# EAGLE schematic PEGMARev0 (EAGLE 6.6.0)
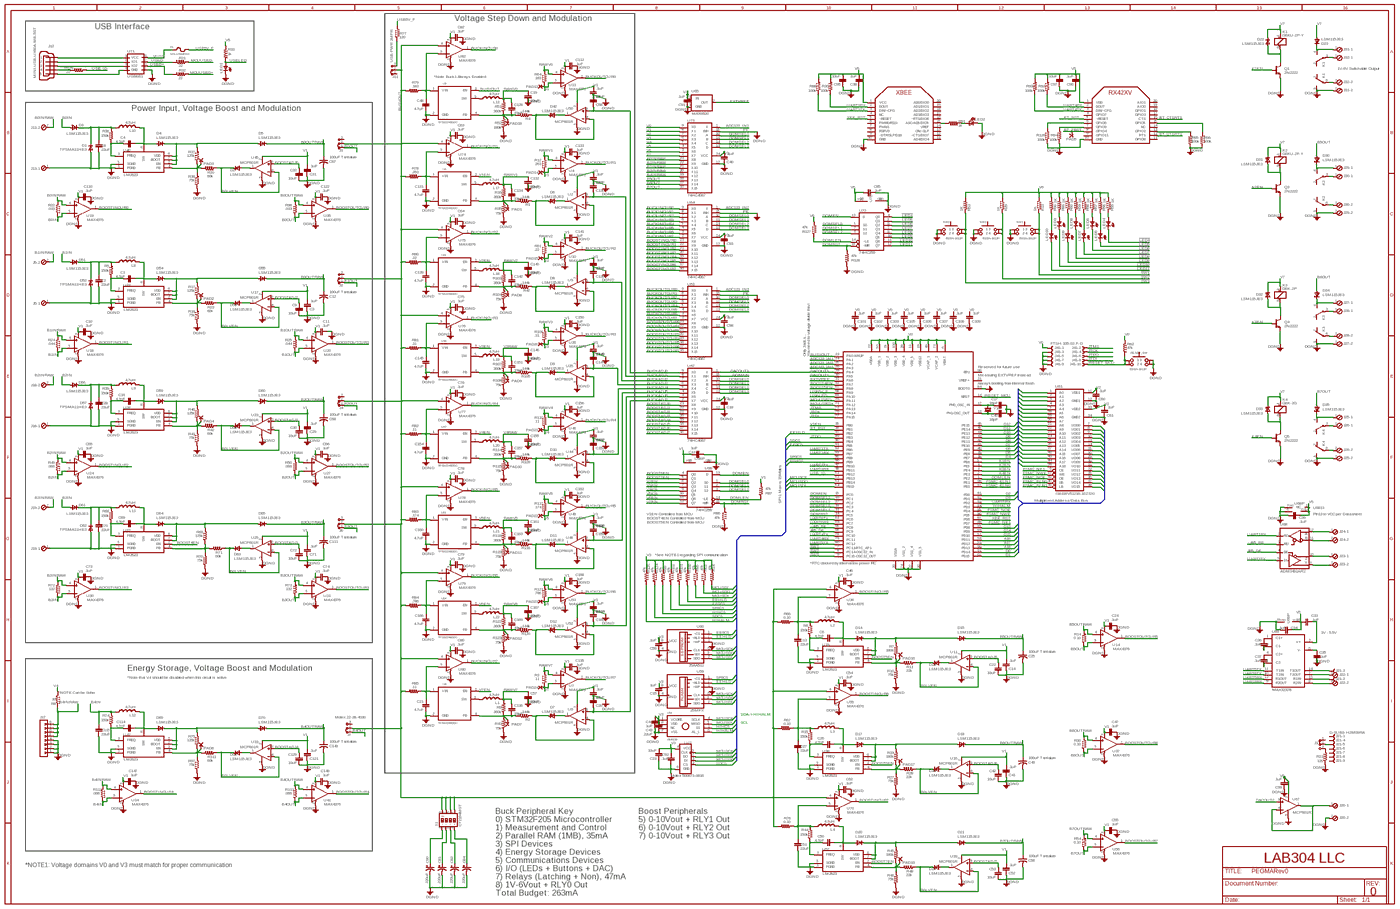
[diagram p0: schematic, sheet 1, overview]
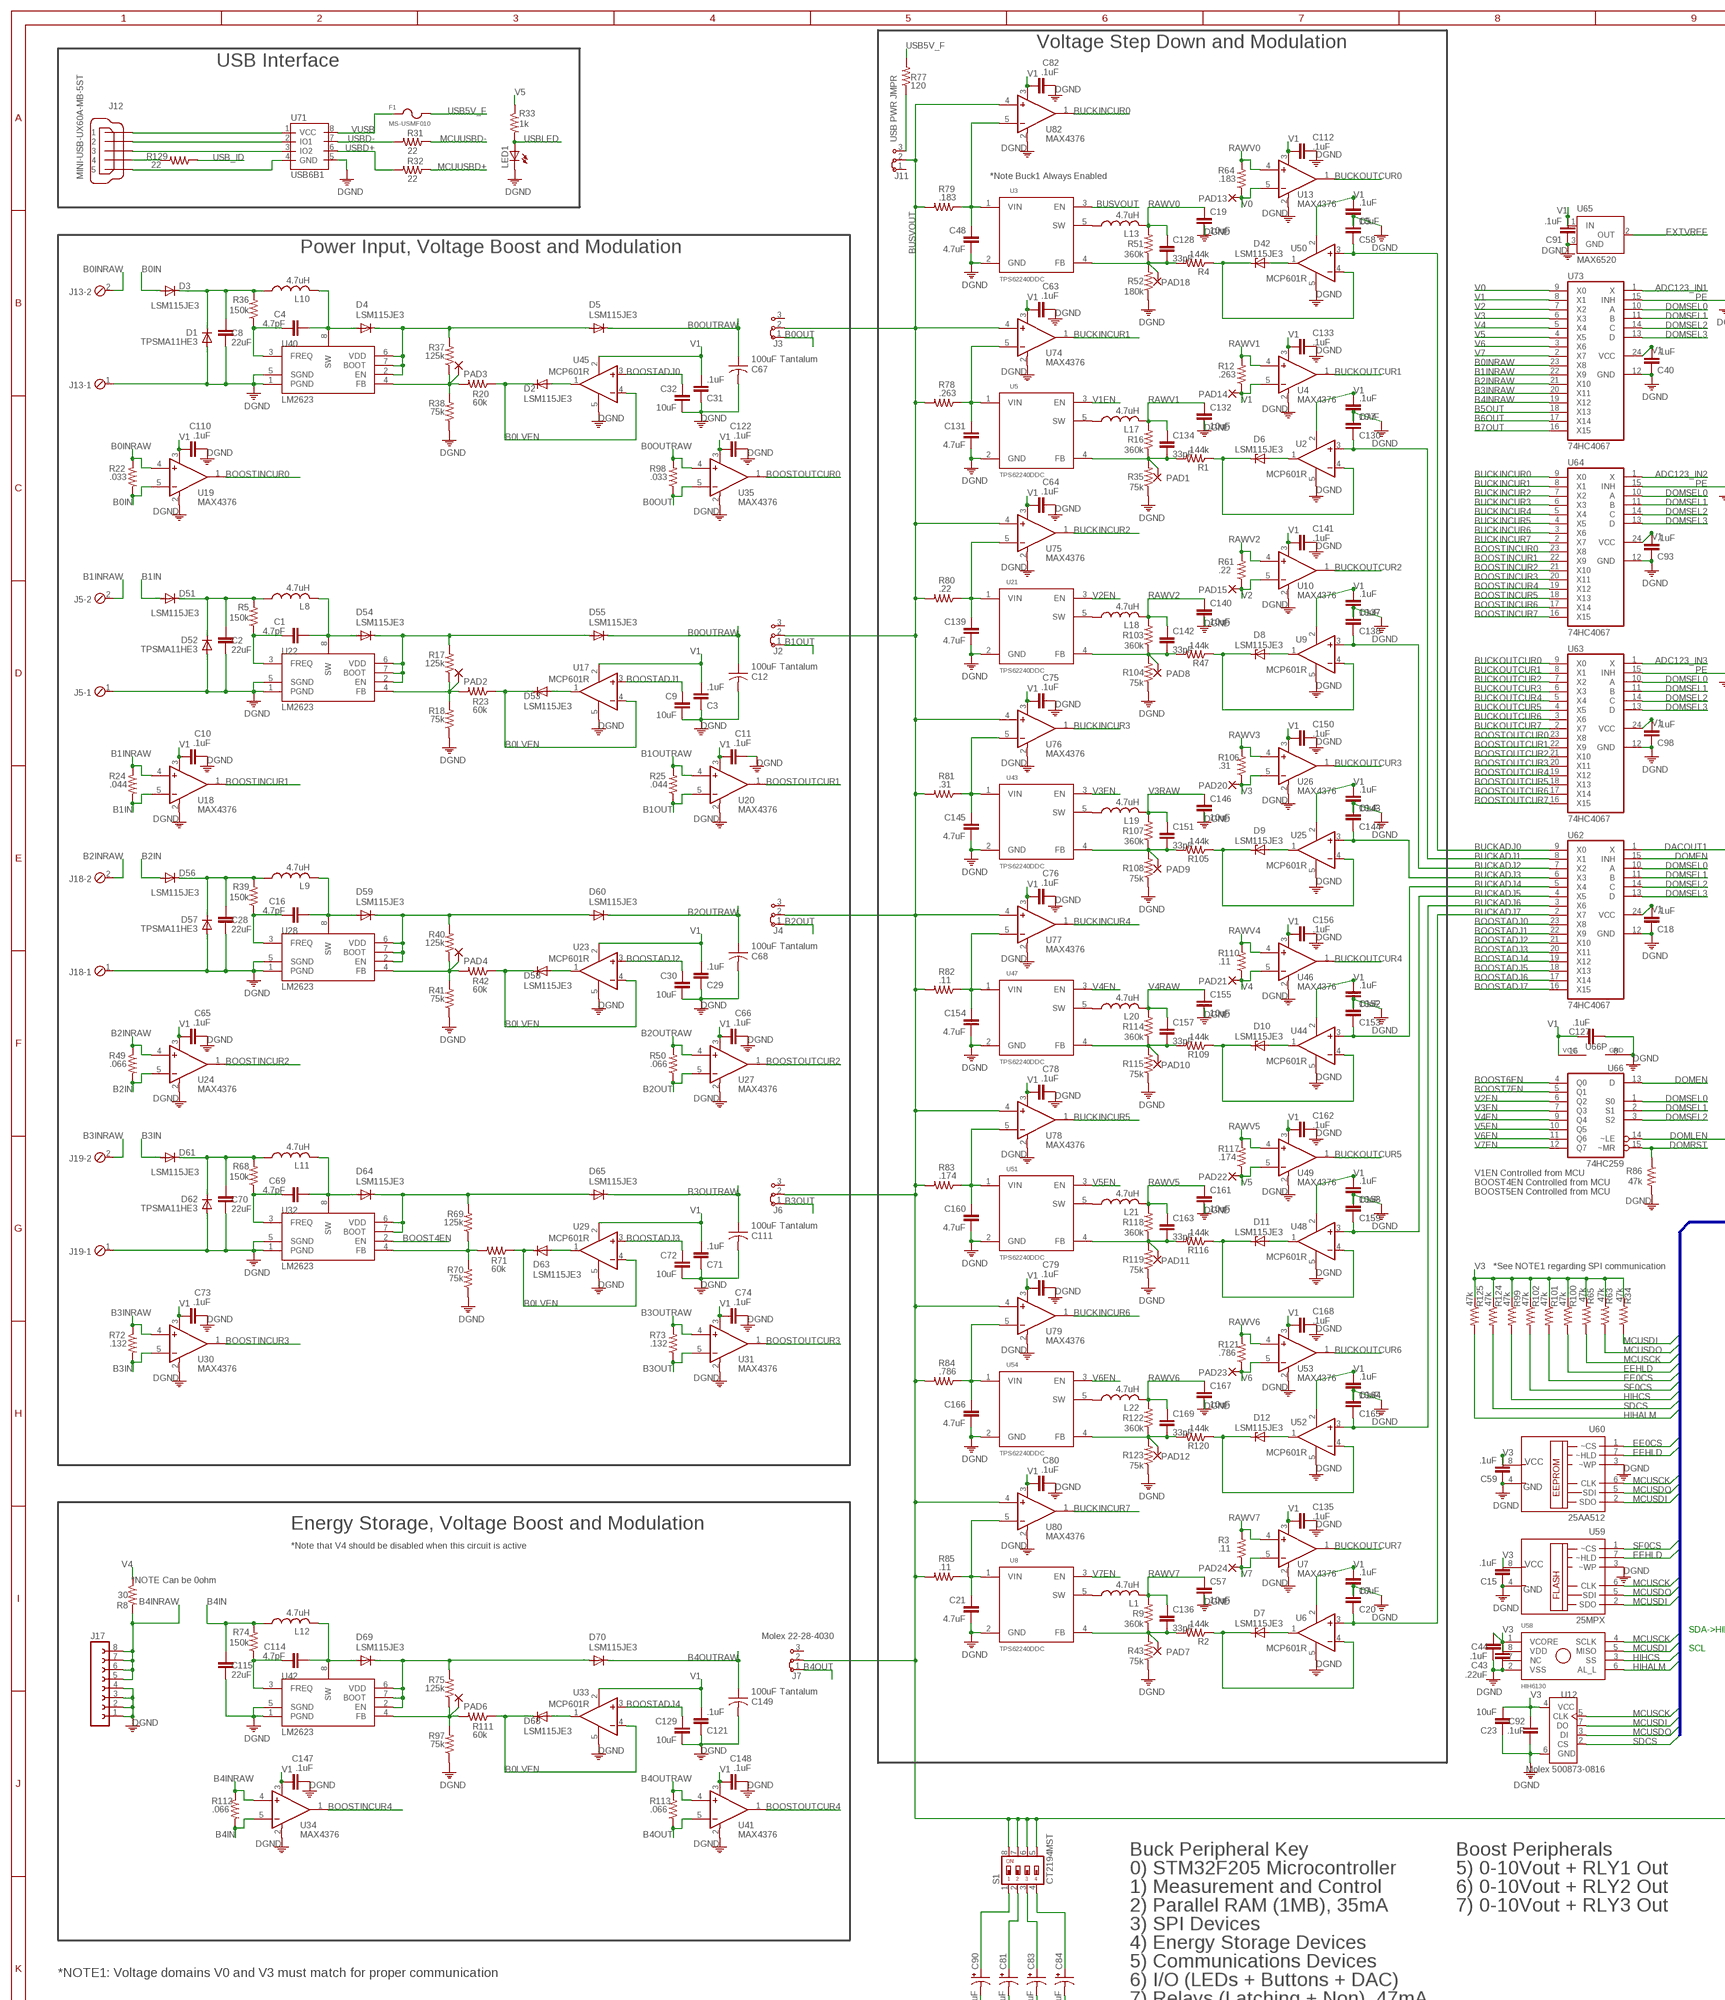
[diagram p1: schematic, sheet 1, part 1 of 4]
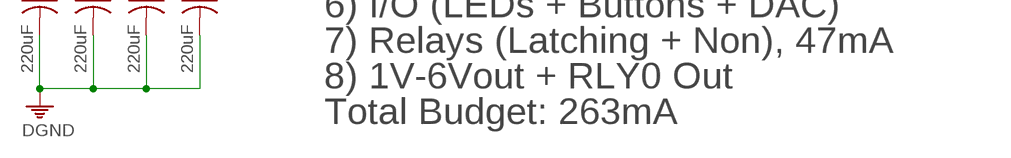
[diagram p2: schematic, sheet 1, part 2 of 4]
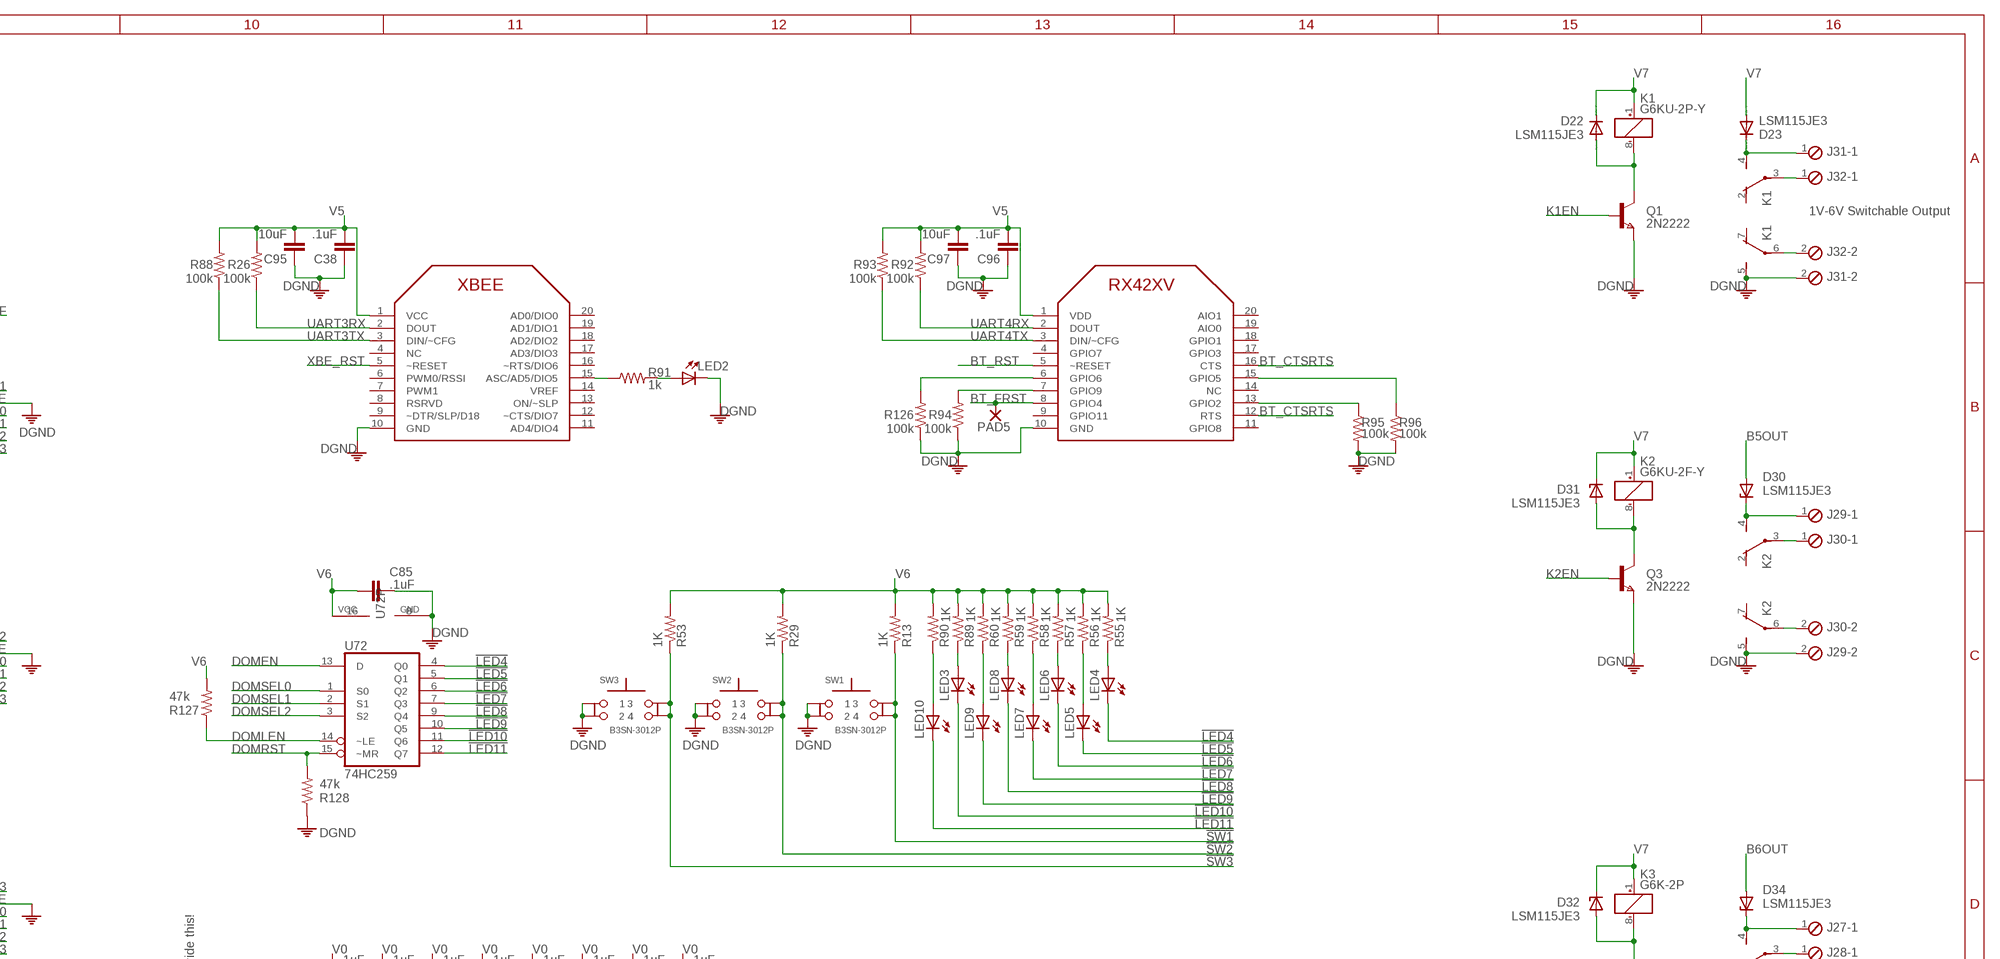
[diagram p3: schematic, sheet 1, part 3 of 4]
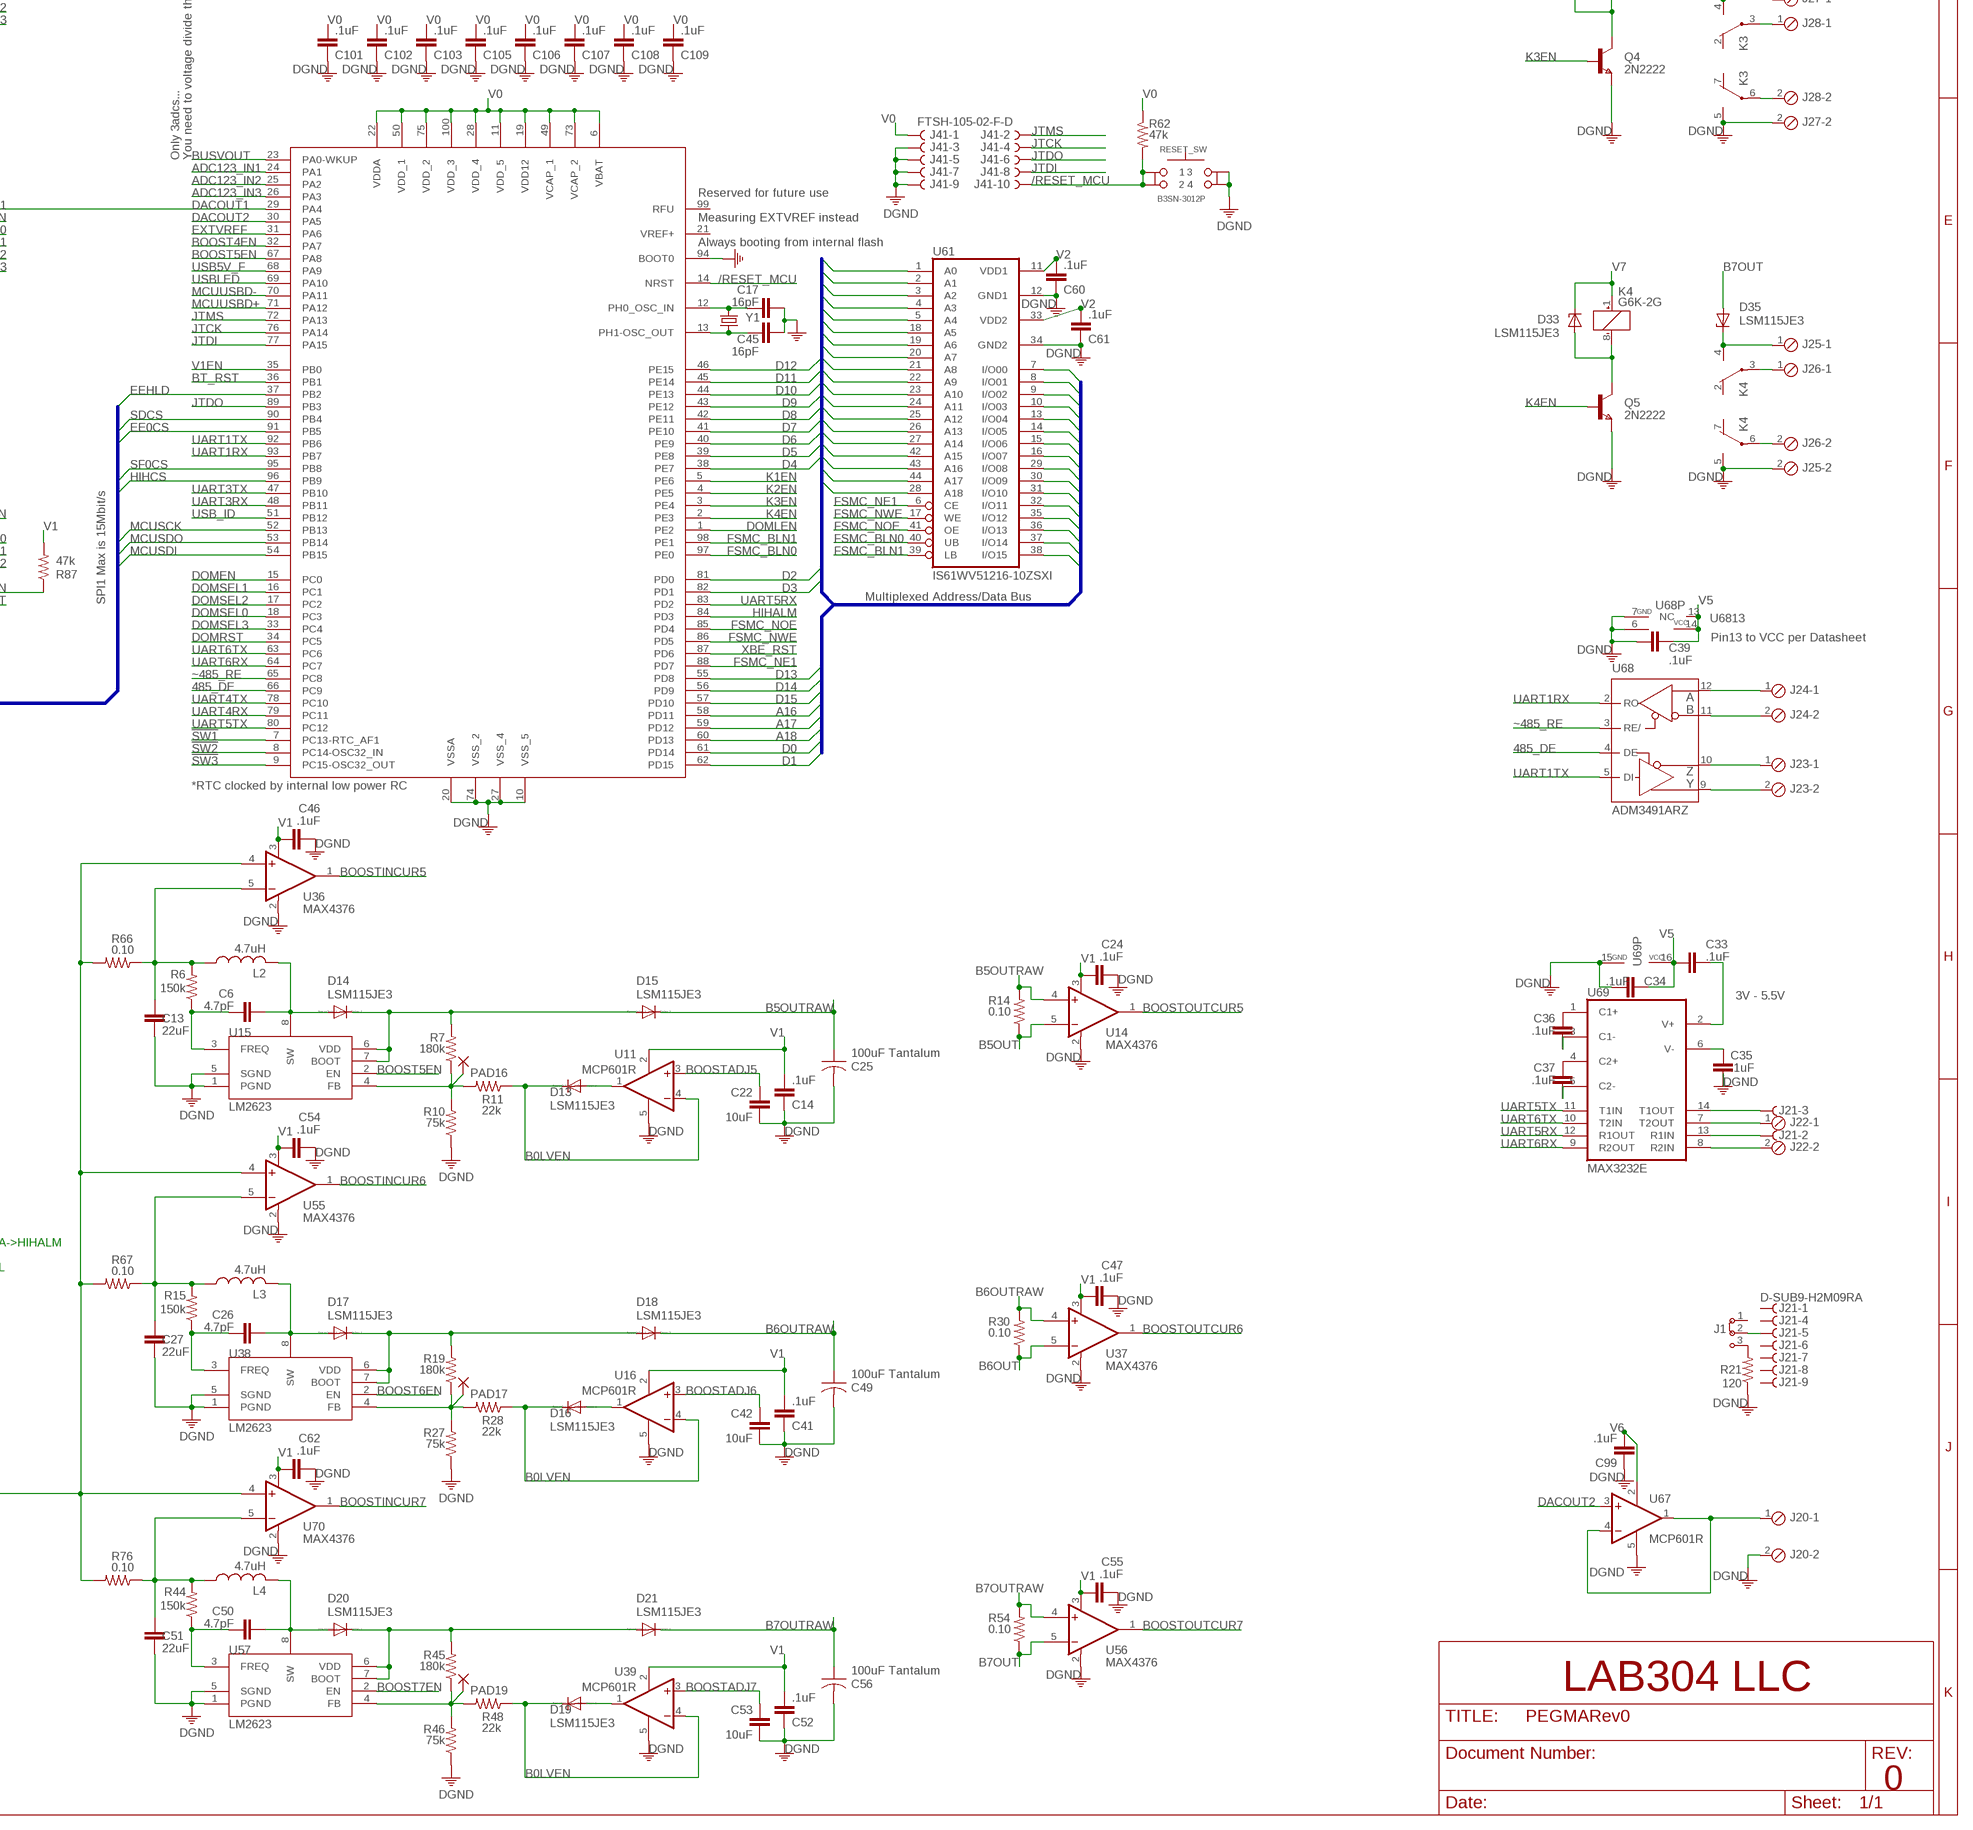
[diagram p4: schematic, sheet 1, part 4 of 4]

## Parts
C1  4.7pF  C-EUC0603  [C0603]
C2  22uF  C-EUC0603  [C0603]
C3  .1uF  C-EUC0603  [C0603]
C4  4.7pF  C-EUC0603  [C0603]
C5  .1uF  C-EUC0603  [C0603]
C6  4.7pF  C-EUC0603  [C0603]
C7  .1uF  C-EUC0603  [C0603]
C8  22uF  C-EUC0603  [C0603]
C9  10uF  C-EUC0603  [C0603]
C10  .1uF  C-EUC0603  [C0603]
C11  .1uF  C-EUC0603  [C0603]
C12  100uF Tantalum  C-USC1812  [C1812]
C13  22uF  C-EUC0603  [C0603]
C14  .1uF  C-EUC0603  [C0603]
C15  .1uF  C-EUC0603  [C0603]
C16  4.7pF  C-EUC0603  [C0603]
C17  16pF  C-EUC0603  [C0603]
C18  .1uF  C-EUC0603  [C0603]
C19  10uF  C-EUC0603  [C0603]
C20  10uF  C-EUC0603  [C0603]
C21  4.7uF  C-EUC0603  [C0603]
C22  10uF  C-EUC0603  [C0603]
C23  10uF  C-EUC0603  [C0603]
C24  .1uF  C-EUC0603  [C0603]
C25  100uF Tantalum  C-USC1812  [C1812]
C26  4.7pF  C-EUC0603  [C0603]
C27  22uF  C-EUC0603  [C0603]
C28  22uF  C-EUC0603  [C0603]
C29  .1uF  C-EUC0603  [C0603]
C30  10uF  C-EUC0603  [C0603]
C31  .1uF  C-EUC0603  [C0603]
C32  10uF  C-EUC0603  [C0603]
C33  .1uF  C-EUC0603  [C0603]
C34  .1uF  C-EUC0603  [C0603]
C35  .1uF  C-EUC0603  [C0603]
C36  .1uF  C-EUC0603  [C0603]
C37  .1uF  C-EUC0603  [C0603]
C38  .1uF  C-EUC0603  [C0603]
C39  .1uF  C-EUC0603  [C0603]
C40  .1uF  C-EUC0603  [C0603]
C41  .1uF  C-EUC0603  [C0603]
C42  10uF  C-EUC0603  [C0603]
C43  .22uF  C-EUC0603  [C0603]
C44  .1uF  C-EUC0603  [C0603]
C45  16pF  C-EUC0603  [C0603]
C46  .1uF  C-EUC0603  [C0603]
C47  .1uF  C-EUC0603  [C0603]
C48  4.7uF  C-EUC0603  [C0603]
C49  100uF Tantalum  C-USC1812  [C1812]
C50  4.7pF  C-EUC0603  [C0603]
C51  22uF  C-EUC0603  [C0603]
C52  .1uF  C-EUC0603  [C0603]
C53  10uF  C-EUC0603  [C0603]
C54  .1uF  C-EUC0603  [C0603]
C55  .1uF  C-EUC0603  [C0603]
C56  100uF Tantalum  C-USC1812  [C1812]
C57  10uF  C-EUC0603  [C0603]
C58  10uF  C-EUC0603  [C0603]
C59  .1uF  C-EUC0603  [C0603]
C60  .1uF  C-EUC0603  [C0603]
C61  .1uF  C-EUC0603  [C0603]
C62  .1uF  C-EUC0603  [C0603]
C63  .1uF  C-EUC0603  [C0603]
C64  .1uF  C-EUC0603  [C0603]
C65  .1uF  C-EUC0603  [C0603]
C66  .1uF  C-EUC0603  [C0603]
C67  100uF Tantalum  C-USC1812  [C1812]
C68  100uF Tantalum  C-USC1812  [C1812]
C69  4.7pF  C-EUC0603  [C0603]
C70  22uF  C-EUC0603  [C0603]
C71  .1uF  C-EUC0603  [C0603]
C72  10uF  C-EUC0603  [C0603]
C73  .1uF  C-EUC0603  [C0603]
C74  .1uF  C-EUC0603  [C0603]
C75  .1uF  C-EUC0603  [C0603]
C76  .1uF  C-EUC0603  [C0603]
C77  .1uF  C-EUC0603  [C0603]
C78  .1uF  C-EUC0603  [C0603]
C79  .1uF  C-EUC0603  [C0603]
C80  .1uF  C-EUC0603  [C0603]
C81  220uF  CPOL-USUD-8X10  [UD-8X10_NICHICON]
C82  .1uF  C-EUC0603  [C0603]
C83  220uF  CPOL-USUD-8X10  [UD-8X10_NICHICON]
C84  220uF  CPOL-USUD-8X10  [UD-8X10_NICHICON]
C85  .1uF  C-EUC0603  [C0603]
C90  220uF  CPOL-USUD-8X10  [UD-8X10_NICHICON]
C91  .1uF  C-EUC0603  [C0603]
C92  .1uF  C-EUC0603  [C0603]
C93  .1uF  C-EUC0603  [C0603]
C95  10uF  C-EUC0603  [C0603]
C96  .1uF  C-EUC0603  [C0603]
C97  10uF  C-EUC0603  [C0603]
C98  .1uF  C-EUC0603  [C0603]
C99  .1uF  C-EUC0603  [C0603]
C101  .1uF  C-EUC0603  [C0603]
C102  .1uF  C-EUC0603  [C0603]
C103  .1uF  C-EUC0603  [C0603]
C105  .1uF  C-EUC0603  [C0603]
C106  .1uF  C-EUC0603  [C0603]
C107  .1uF  C-EUC0603  [C0603]
C108  .1uF  C-EUC0603  [C0603]
C109  .1uF  C-EUC0603  [C0603]
C110  .1uF  C-EUC0603  [C0603]
C111  100uF Tantalum  C-USC1812  [C1812]
C112  .1uF  C-EUC0603  [C0603]
C114  4.7pF  C-EUC0603  [C0603]
C115  22uF  C-EUC0603  [C0603]
C121  .1uF  C-EUC0603  [C0603]
C122  .1uF  C-EUC0603  [C0603]
C127  .1uF  C-EUC0603  [C0603]
C128  33pF  C-EUC0603  [C0603]
C129  10uF  C-EUC0603  [C0603]
C130  10uF  C-EUC0603  [C0603]
C131  4.7uF  C-EUC0603  [C0603]
C132  10uF  C-EUC0603  [C0603]
C133  .1uF  C-EUC0603  [C0603]
C134  33pF  C-EUC0603  [C0603]
C135  .1uF  C-EUC0603  [C0603]
C136  33pF  C-EUC0603  [C0603]
C137  .1uF  C-EUC0603  [C0603]
C138  10uF  C-EUC0603  [C0603]
C139  4.7uF  C-EUC0603  [C0603]
C140  10uF  C-EUC0603  [C0603]
C141  .1uF  C-EUC0603  [C0603]
C142  33pF  C-EUC0603  [C0603]
C143  .1uF  C-EUC0603  [C0603]
C144  10uF  C-EUC0603  [C0603]
C145  4.7uF  C-EUC0603  [C0603]
C146  10uF  C-EUC0603  [C0603]
C147  .1uF  C-EUC0603  [C0603]
C148  .1uF  C-EUC0603  [C0603]
C149  100uF Tantalum  C-USC1812  [C1812]
C150  .1uF  C-EUC0603  [C0603]
C151  33pF  C-EUC0603  [C0603]
C152  .1uF  C-EUC0603  [C0603]
C153  10uF  C-EUC0603  [C0603]
C154  4.7uF  C-EUC0603  [C0603]
C155  10uF  C-EUC0603  [C0603]
C156  .1uF  C-EUC0603  [C0603]
C157  33pF  C-EUC0603  [C0603]
C158  .1uF  C-EUC0603  [C0603]
C159  10uF  C-EUC0603  [C0603]
C160  4.7uF  C-EUC0603  [C0603]
C161  10uF  C-EUC0603  [C0603]
C162  .1uF  C-EUC0603  [C0603]
C163  33pF  C-EUC0603  [C0603]
C164  .1uF  C-EUC0603  [C0603]
C165  10uF  C-EUC0603  [C0603]
C166  4.7uF  C-EUC0603  [C0603]
C167  10uF  C-EUC0603  [C0603]
C168  .1uF  C-EUC0603  [C0603]
C169  33pF  C-EUC0603  [C0603]
D1  TPSMA11HE3  DIODE-DO214AC  [DO214AC]
D2  LSM115JE3  DIODE-DO214BA  [DO214BA]
D3  LSM115JE3  DIODE-DO214BA  [DO214BA]
D4  LSM115JE3  DIODE-DO214BA  [DO214BA]
D5  LSM115JE3  DIODE-DO214BA  [DO214BA]
D6  LSM115JE3  [DO214BA]
D7  LSM115JE3  [DO214BA]
D8  LSM115JE3  [DO214BA]
D9  LSM115JE3  [DO214BA]
D10  LSM115JE3  [DO214BA]
D11  LSM115JE3  [DO214BA]
D12  LSM115JE3  [DO214BA]
D13  LSM115JE3  DIODE-DO214BA  [DO214BA]
D14  LSM115JE3  DIODE-DO214BA  [DO214BA]
D15  LSM115JE3  DIODE-DO214BA  [DO214BA]
D16  LSM115JE3  DIODE-DO214BA  [DO214BA]
D17  LSM115JE3  DIODE-DO214BA  [DO214BA]
D18  LSM115JE3  DIODE-DO214BA  [DO214BA]
D19  LSM115JE3  DIODE-DO214BA  [DO214BA]
D20  LSM115JE3  DIODE-DO214BA  [DO214BA]
D21  LSM115JE3  DIODE-DO214BA  [DO214BA]
D22  LSM115JE3  DIODE-DO214BA  [DO214BA]
D23  LSM115JE3  DIODE-DO214BA  [DO214BA]
D30  LSM115JE3  [DO214BA]
D31  LSM115JE3  [DO214BA]
D32  LSM115JE3  [DO214BA]
D33  LSM115JE3  [DO214BA]
D34  LSM115JE3  [DO214BA]
D35  LSM115JE3  [DO214BA]
D42  LSM115JE3  [DO214BA]
D51  LSM115JE3  DIODE-DO214BA  [DO214BA]
D52  TPSMA11HE3  DIODE-DO214AC  [DO214AC]
D53  LSM115JE3  DIODE-DO214BA  [DO214BA]
D54  LSM115JE3  DIODE-DO214BA  [DO214BA]
D55  LSM115JE3  DIODE-DO214BA  [DO214BA]
D56  LSM115JE3  DIODE-DO214BA  [DO214BA]
D57  TPSMA11HE3  DIODE-DO214AC  [DO214AC]
D58  LSM115JE3  DIODE-DO214BA  [DO214BA]
D59  LSM115JE3  DIODE-DO214BA  [DO214BA]
D60  LSM115JE3  DIODE-DO214BA  [DO214BA]
D61  LSM115JE3  DIODE-DO214BA  [DO214BA]
D62  TPSMA11HE3  DIODE-DO214AC  [DO214AC]
D63  LSM115JE3  DIODE-DO214BA  [DO214BA]
D64  LSM115JE3  DIODE-DO214BA  [DO214BA]
D65  LSM115JE3  DIODE-DO214BA  [DO214BA]
D68  LSM115JE3  DIODE-DO214BA  [DO214BA]
D69  LSM115JE3  DIODE-DO214BA  [DO214BA]
D70  LSM115JE3  DIODE-DO214BA  [DO214BA]
F1  MS-USMF010  FUSE(1210)  [FUSE(1210)]
J1  J2X2MM  [04C]
J2  J2X2MM  [04C]
J3  J2X2MM  [04C]
J4  J2X2MM  [04C]
J5  MPT2  [2POL254]
J6  J2X2MM  [04C]
J7  Molex 22-28-4030  J2X2MM  [04C]
J11  J2X2MM  [04C]
J12  MINI-USB-UX60A-MB-5ST  [UX60A-MB-5ST]
J13  MPT2  [2POL254]
J17  FE08-1  [FE08]
J18  MPT2  [2POL254]
J19  MPT2  [2POL254]
J20  MPT2  [2POL254]
J21  D-SUB9-H2M09RA  [H2M09RA]
J22  MPT2  [2POL254]
J23  MPT2  [2POL254]
J24  MPT2  [2POL254]
J25  MPT2  [2POL254]
J26  MPT2  [2POL254]
J27  MPT2  [2POL254]
J28  MPT2  [2POL254]
J29  MPT2  [2POL254]
J30  MPT2  [2POL254]
J31  MPT2  [2POL254]
J32  MPT2  [2POL254]
J41  FTSH-105-02-F-D  1296-T10  [1296-10]
K1  G6KU-2P-Y  [G6KU-2P-Y]
K2  G6KU-2F-Y  [G6KU-2F-Y]
K3  G6K-2P  [G6K-2P]
K4  G6K-2G  [G6K-2G]
L1  4.7uH  LQM2HP_G0  [L1008/2520METRIC]
L2  4.7uH  LQM2HP_G0  [L1008/2520METRIC]
L3  4.7uH  LQM2HP_G0  [L1008/2520METRIC]
L4  4.7uH  LQM2HP_G0  [L1008/2520METRIC]
L8  4.7uH  LQM2HP_G0  [L1008/2520METRIC]
L9  4.7uH  LQM2HP_G0  [L1008/2520METRIC]
L10  4.7uH  LQM2HP_G0  [L1008/2520METRIC]
L11  4.7uH  LQM2HP_G0  [L1008/2520METRIC]
L12  4.7uH  LQM2HP_G0  [L1008/2520METRIC]
L13  4.7uH  LQM2HP_G0  [L1008/2520METRIC]
L17  4.7uH  LQM2HP_G0  [L1008/2520METRIC]
L18  4.7uH  LQM2HP_G0  [L1008/2520METRIC]
L19  4.7uH  LQM2HP_G0  [L1008/2520METRIC]
L20  4.7uH  LQM2HP_G0  [L1008/2520METRIC]
L21  4.7uH  LQM2HP_G0  [L1008/2520METRIC]
L22  4.7uH  LQM2HP_G0  [L1008/2520METRIC]
LED1  LEDCHIPLED_1206  [CHIPLED_1206]
LED2  LEDCHIPLED_1206  [CHIPLED_1206]
LED3  LEDCHIPLED_1206  [CHIPLED_1206]
LED4  LEDCHIPLED_1206  [CHIPLED_1206]
LED5  LEDCHIPLED_1206  [CHIPLED_1206]
LED6  LEDCHIPLED_1206  [CHIPLED_1206]
LED7  LEDCHIPLED_1206  [CHIPLED_1206]
LED8  LEDCHIPLED_1206  [CHIPLED_1206]
LED9  LEDCHIPLED_1206  [CHIPLED_1206]
LED10  LEDCHIPLED_1206  [CHIPLED_1206]
PAD1  2,54/1,0  [2,54/1,0]
PAD2  2,54/1,0  [2,54/1,0]
PAD3  2,54/1,0  [2,54/1,0]
PAD4  2,54/1,0  [2,54/1,0]
PAD5  2,54/1,0  [2,54/1,0]
PAD6  2,54/1,0  [2,54/1,0]
PAD7  2,54/1,0  [2,54/1,0]
PAD8  2,54/1,0  [2,54/1,0]
PAD9  2,54/1,0  [2,54/1,0]
PAD10  2,54/1,0  [2,54/1,0]
PAD11  2,54/1,0  [2,54/1,0]
PAD12  2,54/1,0  [2,54/1,0]
PAD13  2,54/1,0  [2,54/1,0]
PAD14  2,54/1,0  [2,54/1,0]
PAD15  2,54/1,0  [2,54/1,0]
PAD16  2,54/1,0  [2,54/1,0]
PAD17  2,54/1,0  [2,54/1,0]
PAD18  2,54/1,0  [2,54/1,0]
PAD19  2,54/1,0  [2,54/1,0]
PAD20  2,54/1,0  [2,54/1,0]
PAD21  2,54/1,0  [2,54/1,0]
PAD22  2,54/1,0  [2,54/1,0]
PAD23  2,54/1,0  [2,54/1,0]
PAD24  2,54/1,0  [2,54/1,0]
Q1  2N2222  NPNSOT323  [SOT323]
Q3  2N2222  NPNSOT323  [SOT323]
Q4  2N2222  NPNSOT323  [SOT323]
Q5  2N2222  NPNSOT323  [SOT323]
R1  144k  R-US_R0603  [R0603]
R2  144k  R-US_R0603  [R0603]
R3  .11  R-US_R0603  [R0603]
R4  144k  R-US_R0603  [R0603]
R5  150k  R-US_R0603  [R0603]
R6  150k  R-US_R0603  [R0603]
R7  180k  R-US_R0603  [R0603]
R8  30  R-US_R0603  [R0603]
R9  360k  R-US_R0603  [R0603]
R10  75k  R-US_R0603  [R0603]
R11  22k  R-US_R0603  [R0603]
R12  .263  R-US_R0603  [R0603]
R13  1K  R-US_R0603  [R0603]
R14  0.10  R-US_R0603  [R0603]
R15  150k  R-US_R0603  [R0603]
R16  360k  R-US_R0603  [R0603]
R17  125k  R-US_R0603  [R0603]
R18  75k  R-US_R0603  [R0603]
R19  180k  R-US_R0603  [R0603]
R20  60k  R-US_R0603  [R0603]
R21  120  R-US_R1206  [R1206]
R22  .033  R-US_R0603  [R0603]
R23  60k  R-US_R0603  [R0603]
R24  .044  R-US_R0603  [R0603]
R25  .044  R-US_R0603  [R0603]
R26  100k  R-US_R0603  [R0603]
R27  75k  R-US_R0603  [R0603]
R28  22k  R-US_R0603  [R0603]
R29  1K  R-US_R0603  [R0603]
R30  0.10  R-US_R0603  [R0603]
R31  22  R-US_R0603  [R0603]
R32  22  R-US_R0603  [R0603]
R33  1k  R-US_R0603  [R0603]
R34  47k  R-US_R0603  [R0603]
R35  75k  R-US_R0603  [R0603]
R36  150k  R-US_R0603  [R0603]
R37  125k  R-US_R0603  [R0603]
R38  75k  R-US_R0603  [R0603]
R39  150k  R-US_R0603  [R0603]
R40  125k  R-US_R0603  [R0603]
R41  75k  R-US_R0603  [R0603]
R42  60k  R-US_R0603  [R0603]
R43  75k  R-US_R0603  [R0603]
R44  150k  R-US_R0603  [R0603]
R45  180k  R-US_R0603  [R0603]
R46  75k  R-US_R0603  [R0603]
R47  144k  R-US_R0603  [R0603]
R48  22k  R-US_R0603  [R0603]
R49  .066  R-US_R0603  [R0603]
R50  .066  R-US_R0603  [R0603]
R51  360k  R-US_R0603  [R0603]
R52  180k  R-US_R0603  [R0603]
R53  1K  R-US_R0603  [R0603]
R54  0.10  R-US_R0603  [R0603]
R55  1K  R-US_R0603  [R0603]
R56  1K  R-US_R0603  [R0603]
R57  1K  R-US_R0603  [R0603]
R58  1K  R-US_R0603  [R0603]
R59  1K  R-US_R0603  [R0603]
R60  1K  R-US_R0603  [R0603]
R61  .22  R-US_R0603  [R0603]
R62  47k  R-US_R0603  [R0603]
R63  47k  R-US_R0603  [R0603]
R64  .183  R-US_R0603  [R0603]
R65  47k  R-US_R0603  [R0603]
R66  0.10  R-US_R0603  [R0603]
R67  0.10  R-US_R0603  [R0603]
R68  150k  R-US_R0603  [R0603]
R69  125k  R-US_R0603  [R0603]
R70  75k  R-US_R0603  [R0603]
R71  60k  R-US_R0603  [R0603]
R72  .132  R-US_R0603  [R0603]
R73  .132  R-US_R0603  [R0603]
R74  150k  R-US_R0603  [R0603]
R75  125k  R-US_R0603  [R0603]
R76  0.10  R-US_R0603  [R0603]
R77  120  R-US_M1206  [M1206]
R78  .263  R-US_R0603  [R0603]
R79  .183  R-US_R0603  [R0603]
R80  .22  R-US_R0603  [R0603]
R81  .31  R-US_R0603  [R0603]
R82  .11  R-US_R0603  [R0603]
R83  .174  R-US_R0603  [R0603]
R84  .786  R-US_R0603  [R0603]
R85  .11  R-US_R0603  [R0603]
R86  47k  R-US_R0603  [R0603]
R87  47k  R-US_R0603  [R0603]
R88  100k  R-US_R0603  [R0603]
R89  1K  R-US_R0603  [R0603]
R90  1K  R-US_R0603  [R0603]
R91  1k  R-US_R0603  [R0603]
R92  100k  R-US_R0603  [R0603]
R93  100k  R-US_R0603  [R0603]
R94  100k  R-US_R0603  [R0603]
R95  100k  R-US_R0603  [R0603]
R96  100k  R-US_R0603  [R0603]
R97  75k  R-US_R0603  [R0603]
R98  .033  R-US_R0603  [R0603]
R99  47k  R-US_R0603  [R0603]
R100  47k  R-US_R0603  [R0603]
R101  47k  R-US_R0603  [R0603]
R102  47k  R-US_R0603  [R0603]
R103  360k  R-US_R0603  [R0603]
R104  75k  R-US_R0603  [R0603]
R105  144k  R-US_R0603  [R0603]
R106  .31  R-US_R0603  [R0603]
R107  360k  R-US_R0603  [R0603]
R108  75k  R-US_R0603  [R0603]
R109  144k  R-US_R0603  [R0603]
R110  .11  R-US_R0603  [R0603]
R111  60k  R-US_R0603  [R0603]
R112  .066  R-US_R0603  [R0603]
R113  .066  R-US_R0603  [R0603]
R114  360k  R-US_R0603  [R0603]
R115  75k  R-US_R0603  [R0603]
R116  144k  R-US_R0603  [R0603]
R117  .174  R-US_R0603  [R0603]
R118  360k  R-US_R0603  [R0603]
R119  75k  R-US_R0603  [R0603]
R120  144k  R-US_R0603  [R0603]
R121  .786  R-US_R0603  [R0603]
R122  360k  R-US_R0603  [R0603]
R123  75k  R-US_R0603  [R0603]
R124  47k  R-US_R0603  [R0603]
R125  47k  R-US_R0603  [R0603]
R126  100k  R-US_R0603  [R0603]
R127  47k  R-US_R0603  [R0603]
R128  47k  R-US_R0603  [R0603]
R129  22  R-US_R0603  [R0603]
RESET_SW  B3SN-3012P  SWITCH(B3SN)  [SWITCH(B3SN)]
S1  CT2194MST  SWS004  [SMS-004]
SW1  B3SN-3012P  SWITCH(B3SN)  [SWITCH(B3SN)]
SW2  B3SN-3012P  SWITCH(B3SN)  [SWITCH(B3SN)]
SW3  B3SN-3012P  SWITCH(B3SN)  [SWITCH(B3SN)]
U1  STM32F205VG  [PZ100]
U2  MCP601R  [SOT23-5]
U3  TPS62240DDC  [SOT23-5]
U4  MAX4376  [SOT23-5]
U5  TPS62240DDC  [SOT23-5]
U6  MCP601R  [SOT23-5]
U7  MAX4376  [SOT23-5]
U8  TPS62240DDC  [SOT23-5]
U9  MCP601R  [SOT23-5]
U10  MAX4376  [SOT23-5]
U11  MCP601R  [SOT23-5]
U12  Molex 500873-0816  SF-MICROSD  [MICROSD]
U13  MAX4376  [SOT23-5]
U14  MAX4376  [SOT23-5]
U15  LM2623  [MSOP8]
U16  MCP601R  [SOT23-5]
U17  MCP601R  [SOT23-5]
U18  MAX4376  [SOT23-5]
U19  MAX4376  [SOT23-5]
U20  MAX4376  [SOT23-5]
U21  TPS62240DDC  [SOT23-5]
U22  LM2623  [MSOP8]
U23  MCP601R  [SOT23-5]
U24  MAX4376  [SOT23-5]
U25  MCP601R  [SOT23-5]
U26  MAX4376  [SOT23-5]
U27  MAX4376  [SOT23-5]
U28  LM2623  [MSOP8]
U29  MCP601R  [SOT23-5]
U30  MAX4376  [SOT23-5]
U31  MAX4376  [SOT23-5]
U32  LM2623  [MSOP8]
U33  MCP601R  [SOT23-5]
U34  MAX4376  [SOT23-5]
U35  MAX4376  [SOT23-5]
U36  MAX4376  [SOT23-5]
U37  MAX4376  [SOT23-5]
U38  LM2623  [MSOP8]
U39  MCP601R  [SOT23-5]
U40  LM2623  [MSOP8]
U41  MAX4376  [SOT23-5]
U42  LM2623  [MSOP8]
U43  TPS62240DDC  [SOT23-5]
U44  MCP601R  [SOT23-5]
U45  MCP601R  [SOT23-5]
U46  MAX4376  [SOT23-5]
U47  TPS62240DDC  [SOT23-5]
U48  MCP601R  [SOT23-5]
U49  MAX4376  [SOT23-5]
U50  MCP601R  [SOT23-5]
U51  TPS62240DDC  [SOT23-5]
U52  MCP601R  [SOT23-5]
U53  MAX4376  [SOT23-5]
U54  TPS62240DDC  [SOT23-5]
U55  MAX4376  [SOT23-5]
U56  MAX4376  [SOT23-5]
U57  LM2623  [MSOP8]
U58  HIH6130  HIH6131  [SO-08M]
U59  25MPX  [SO-08M]
U60  25AA512  [SO-08M]
U61  IS61WV51216-10ZSXI  [TSOPII-Z44]
U62  74HC4067  4067D  [SO24W]
U63  74HC4067  4067D  [SO24W]
U64  74HC4067  4067D  [SO24W]
U65  MAX6520  [SOT23]
U66  74HC259  74259D  [SO16]
U67  MCP601R  [SOT23-5]
U68  ADM3491ARZ  MAX489CSD  [SO14]
U69  MAX3232E  MAX232ECWE  [SO16L]
U70  MAX4376  [SOT23-5]
U71  USB6B1  [SO08]
U72  74HC259  74259D  [SO16]
U73  74HC4067  4067D  [SO24W]
U74  MAX4376  [SOT23-5]
U75  MAX4376  [SOT23-5]
U76  MAX4376  [SOT23-5]
U77  MAX4376  [SOT23-5]
U78  MAX4376  [SOT23-5]
U79  MAX4376  [SOT23-5]
U80  MAX4376  [SOT23-5]
U81  RN42XV  [RN42XV]
U82  MAX4376  [SOT23-5]
U$25  XBEE802.15.4  [XBEE]
Y1  CRYSTALHC49UP  [HC49UP]

## Nets
485_DE: U1.66(PC9) U68.4(DE)
!LED4: LED4.C U72.4(Q0)
!LED5: LED5.C U72.5(Q1)
!LED6: LED6.C U72.6(Q2)
!LED7: LED7.C U72.7(Q3)
!LED8: LED8.C U72.9(Q4)
!LED9: LED9.C U72.10(Q5)
!LED10: LED3.C U72.11(Q6)
!LED11: LED10.C U72.12(Q7)
!SW1: R13.1 SW1.3 SW1.4 U1.7(PC13-RTC_AF1)
!SW2: R29.1 SW2.3 SW2.4 U1.8(PC14-OSC32_IN)
!SW3: R53.1 SW3.3 SW3.4 U1.9(PC15-OSC32_OUT)
/RESET_MCU: J41.10 R62.2 RESET_SW.1 RESET_SW.2 U1.14(NRST)
A16: U1.58(PD11) U61.43(A16)
A17: U1.59(PD12) U61.44(A17)
A18: U1.60(PD13) U61.28(A18)
ADC123_IN1: U1.24(PA1) U73.1(X)
ADC123_IN2: U1.25(PA2) U64.1(X)
ADC123_IN3: U1.26(PA3) U63.1(X)
B0IN: D3.A R22.2 U19.5(-IN)
B0INRAW: J13.2 R22.1 U19.4(+IN) U73.23(X8)
B0LVEN: D2.C D13.C D16.C D19.C D53.C D58.C D63.C D68.C R11.1 R20.1 R23.1 R28.1 R42.1 R48.1 R71.1 R111.1 U11.4(-IN) U16.4(-IN) U17.4(-IN) U23.4(-IN) U29.4(-IN) U33.4(-IN) U39.4(-IN) U45.4(-IN)
B0OUT: J3.1 R98.1 U35.5(-IN)
B0OUTRAW: C12.1 C67.1 D5.C D55.C R98.2 U35.4(+IN)
B1IN: D51.A R24.2 U18.5(-IN)
B1INRAW: J5.2 R24.1 U18.4(+IN) U73.22(X9)
B1OUT: J2.1 R25.1 U20.5(-IN)
B1OUTRAW: R25.2 U20.4(+IN)
B2IN: D56.A R49.2 U24.5(-IN)
B2INRAW: J18.2 R49.1 U24.4(+IN) U73.21(X10)
B2OUT: J4.1 R50.1 U27.5(-IN)
B2OUTRAW: C68.1 D60.C R50.2 U27.4(+IN)
B3IN: D61.A R72.2 U30.5(-IN)
B3INRAW: J19.2 R72.1 U30.4(+IN) U73.20(X11)
B3OUT: J6.1 R73.1 U31.5(-IN)
B3OUTRAW: C111.1 D65.C R73.2 U31.4(+IN)
B4IN: C115.2 L12.1 R74.2 R112.2 U34.5(-IN)
B4INRAW: J17.5 J17.6 J17.7 J17.8 R8.2 R112.1 U34.4(+IN) U73.19(X12)
B4OUT: J7.1 R113.1 U41.5(-IN)
B4OUTRAW: C149.1 D70.C R113.2 U41.4(+IN)
B5INRAW: C13.2 L2.1 R6.2 R66.1 U36.5(-IN)
B5OUT: D30.A R14.1 U14.5(-IN) U73.18(X13)
B5OUTRAW: C25.1 D15.C R14.2 U14.4(+IN)
B6INRAW: C27.2 L3.1 R15.2 R67.1 U55.5(-IN)
B6OUT: D34.A R30.1 U37.5(-IN) U73.17(X14)
B6OUTRAW: C49.1 D18.C R30.2 U37.4(+IN)
B7INRAW: C51.2 L4.1 R44.2 R76.1 U70.5(-IN)
B7OUT: D35.A R54.1 U56.5(-IN) U73.16(X15)
B7OUTRAW: C56.1 D21.C R54.2 U56.4(+IN)
BOOST4EN: U1.32(PA7) U32.2(EN)
BOOST5EN: U1.67(PA8) U15.2(EN)
BOOST6EN: U38.2(EN) U66.4(Q0)
BOOST7EN: U57.2(EN) U66.5(Q1)
BOOSTADJ0: C32.1 U45.3(+IN) U62.23(X8)
BOOSTADJ1: C9.1 U17.3(+IN) U62.22(X9)
BOOSTADJ2: C30.1 U23.3(+IN) U62.21(X10)
BOOSTADJ3: C72.1 U29.3(+IN) U62.20(X11)
BOOSTADJ4: C129.1 U33.3(+IN) U62.19(X12)
BOOSTADJ5: C22.1 U11.3(+IN) U62.18(X13)
BOOSTADJ6: C42.1 U16.3(+IN) U62.17(X14)
BOOSTADJ7: C53.1 U39.3(+IN) U62.16(X15)
BOOSTINCUR0: U19.1(OUT) U64.23(X8)
BOOSTINCUR1: U18.1(OUT) U64.22(X9)
BOOSTINCUR2: U24.1(OUT) U64.21(X10)
BOOSTINCUR3: U30.1(OUT) U64.20(X11)
BOOSTINCUR4: U34.1(OUT) U64.19(X12)
BOOSTINCUR5: U36.1(OUT) U64.18(X13)
BOOSTINCUR6: U55.1(OUT) U64.17(X14)
BOOSTINCUR7: U64.16(X15) U70.1(OUT)
BOOSTOUTCUR0: U35.1(OUT) U63.23(X8)
BOOSTOUTCUR1: U20.1(OUT) U63.22(X9)
BOOSTOUTCUR2: U27.1(OUT) U63.21(X10)
BOOSTOUTCUR3: U31.1(OUT) U63.20(X11)
BOOSTOUTCUR4: U41.1(OUT) U63.19(X12)
BOOSTOUTCUR5: U14.1(OUT) U63.18(X13)
BOOSTOUTCUR6: U37.1(OUT) U63.17(X14)
BOOSTOUTCUR7: U56.1(OUT) U63.16(X15)
BT_CTSRTS: U81.12(RTS) U81.16(CTS)
BT_FRST: PAD5.1(P) U81.8(GPIO4)
BT_RST: U1.36(PB1) U81.5(~RESET)
BUCKADJ0: C58.1 U50.3(+IN) U62.9(X0)
BUCKADJ1: C130.1 U2.3(+IN) U62.8(X1)
BUCKADJ2: C138.1 U9.3(+IN) U62.7(X2)
BUCKADJ3: C144.1 U25.3(+IN) U62.6(X3)
BUCKADJ4: C153.1 U44.3(+IN) U62.5(X4)
BUCKADJ5: C159.1 U48.3(+IN) U62.4(X5)
BUCKADJ6: C165.1 U52.3(+IN) U62.3(X6)
BUCKADJ7: C20.1 U6.3(+IN) U62.2(X7)
BUCKINCUR0: U64.9(X0) U82.1(OUT)
BUCKINCUR1: U64.8(X1) U74.1(OUT)
BUCKINCUR2: U64.7(X2) U75.1(OUT)
BUCKINCUR3: U64.6(X3) U76.1(OUT)
BUCKINCUR4: U64.5(X4) U77.1(OUT)
BUCKINCUR5: U64.4(X5) U78.1(OUT)
BUCKINCUR6: U64.3(X6) U79.1(OUT)
BUCKINCUR7: U64.2(X7) U80.1(OUT)
BUCKOUTCUR0: U13.1(OUT) U63.9(X0)
BUCKOUTCUR1: U4.1(OUT) U63.8(X1)
BUCKOUTCUR2: U10.1(OUT) U63.7(X2)
BUCKOUTCUR3: U26.1(OUT) U63.6(X3)
BUCKOUTCUR4: U46.1(OUT) U63.5(X4)
BUCKOUTCUR5: U49.1(OUT) U63.4(X5)
BUCKOUTCUR6: U53.1(OUT) U63.3(X6)
BUCKOUTCUR7: U7.1(OUT) U63.2(X7)
BUSVOUT: J2.2 J3.2 J4.2 J6.2 J7.2 J11.2 R66.2 R67.2 R76.2 R78.2 R79.2 R80.2 R81.2 R82.2 R83.2 R84.2 R85.2 S1.5 S1.6 S1.7 S1.8 U1.23(PA0-WKUP) U3.3(EN) U36.4(+IN) U55.4(+IN) U70.4(+IN) U74.4(+IN) U75.4(+IN) U76.4(+IN) U77.4(+IN) U78.4(+IN) U79.4(+IN) U80.4(+IN) U82.4(+IN)
D0: U1.61(PD14) U61.1(A0) U61.7(I/O00)
D1: U1.62(PD15) U61.2(A1) U61.8(I/O01)
D2: U1.81(PD0) U61.3(A2) U61.9(I/O02)
D3: U1.82(PD1) U61.4(A3) U61.10(I/O03)
D4: U1.38(PE7) U61.5(A4) U61.13(I/O04)
D5: U1.39(PE8) U61.14(I/O05) U61.18(A5)
D6: U1.40(PE9) U61.15(I/O06) U61.19(A6)
D7: U1.41(PE10) U61.16(I/O07) U61.20(A7)
D8: U1.42(PE11) U61.21(A8) U61.29(I/O08)
D9: U1.43(PE12) U61.22(A9) U61.30(I/O09)
D10: U1.44(PE13) U61.23(A10) U61.31(I/O10)
D11: U1.45(PE14) U61.24(A11) U61.32(I/O11)
D12: U1.46(PE15) U61.25(A12) U61.35(I/O12)
D13: U1.55(PD8) U61.26(A13) U61.36(I/O13)
D14: U1.56(PD9) U61.27(A14) U61.37(I/O14)
D15: U1.57(PD10) U61.38(I/O15) U61.42(A15)
DACOUT1: U1.29(PA4) U62.1(X)
DACOUT2: U1.30(PA5) U67.3(+IN)
DOMEN: U1.15(PC0) U62.15(INH) U66.13(D) U72.13(D)
DOMLEN: R87.1 R127.1 U1.1(PE2) U66.14(~LE) U72.14(~LE)
DOMRST: R86.1 R128.2 U1.34(PC5) U66.15(~MR) U72.15(~MR)
DOMSEL0: U1.18(PC3) U62.10(A) U63.10(A) U64.10(A) U66.1(S0) U72.1(S0) U73.10(A)
DOMSEL1: U1.16(PC1) U62.11(B) U63.11(B) U64.11(B) U66.2(S1) U72.2(S1) U73.11(B)
DOMSEL2: U1.17(PC2) U62.14(C) U63.14(C) U64.14(C) U66.3(S2) U72.3(S2) U73.14(C)
DOMSEL3: U1.33(PC4) U62.13(D) U63.13(D) U64.13(D) U73.13(D)
EE0CS: R101.2 U1.91(PB5) U60.1(~CS)
EEHLD: R100.2 U1.37(PB2) U59.7(~HLD) U60.7(~HLD)
EXTVREF: U1.31(PA6) U65.2(OUT)
FSMC_BLN0: U1.97(PE0) U61.40(UB)
FSMC_BLN1: U1.98(PE1) U61.39(LB)
FSMC_NE1: U1.88(PD7) U61.6(CE)
FSMC_NOE: U1.85(PD4) U61.41(OE)
FSMC_NWE: U1.86(PD5) U61.17(WE)
HIHALM: R125.2 U1.84(PD3) U58.6(AL_L)
HIHCS: R99.2 U1.96(PB9) U58.3(SS)
JTCK: J41.4 U1.76(PA14)
JTDI: J41.8 U1.77(PA15)
JTDO: J41.6 U1.89(PB3)
JTMS: J41.2 U1.72(PA13)
K1EN: Q1.2(B) U1.5(PE6)
K2EN: Q3.2(B) U1.4(PE5)
K3EN: Q4.2(B) U1.3(PE4)
K4EN: Q5.2(B) U1.2(PE3)
MCUSCK: R65.1 U1.52(PB13) U12.5(CLK) U58.4(SCLK) U59.6(CLK) U60.6(CLK)
MCUSDI: R34.1 U1.54(PB15) U12.7(DO) U58.5(MISO) U59.2(SDO) U60.2(SDO)
MCUSDO: R63.1 U1.53(PB14) U12.3(DI) U59.5(SDI) U60.5(SDI)
MCUUSBD+: R32.1 U1.71(PA12)
MCUUSBD-: R31.1 U1.70(PA11)
N$1: C131.1 R78.1 U5.1(VIN) U74.5(-IN)
N$2: C8.2 D1.C D3.C L10.1 R36.2
N$3: J22.1 U69.7(T2OUT)
N$4: PAD3.1(P) R20.2 R37.1 R38.2 U40.4(FB)
N$5: C4.1 R36.1 U40.3(FREQ)
N$6: C2.2 D51.C D52.C L8.1 R5.2
N$7: J22.2 U69.8(R2IN)
N$8: C4.2 D4.A L10.2 U40.8(SW)
N$10: D42.C R4.1 U50.4(-IN)
N$11: PAD16.1(P) R7.1 R10.2 R11.2 U15.4(FB)
N$12: PAD2.1(P) R17.1 R18.2 R23.2 U22.4(FB)
N$13: C1.1 R5.1 U22.3(FREQ)
N$14: R126.2 U81.6(GPIO6)
N$15: C1.2 D54.A L8.2 U22.8(SW)
N$16: C6.1 R6.1 U15.3(FREQ)
N$17: C6.2 D14.A L2.2 U15.8(SW)
N$18: L13.1 U3.5(SW)
N$19: D7.C R2.1 U6.4(-IN)
N$20: D4.C D5.A R37.2 U40.2(EN) U40.6(VDD) U40.7(BOOT)
N$21: D14.C D15.A R7.2 U15.6(VDD) U15.7(BOOT)
N$22: D13.A U11.1(OUT)
N$23: R94.2 U81.7(GPIO9)
N$24: R95.1 U81.13(GPIO2)
N$25: PAD17.1(P) R19.1 R27.2 R28.2 U38.4(FB)
N$26: J1.2 J21.5
N$27: C48.1 R79.1 U3.1(VIN) U82.5(-IN)
N$28: D54.C D55.A R17.2 U22.2(EN) U22.6(VDD) U22.7(BOOT)
N$29: D53.A U17.1(OUT)
N$30: C33.1 U69.2(V+)
N$31: C17.2 U1.12(PH0_OSC_IN) Y1.2
N$32: C45.1 U1.13(PH1-OSC_OUT) Y1.1
N$33: D2.A U45.1(OUT)
N$34: C136.2 PAD7.1(P) R2.2 R9.1 R43.2 U8.4(FB)
N$35: L1.1 U8.5(SW)
N$36: D31.A K2.8(1:-) Q3.1(C)
N$37: C139.1 R80.1 U21.1(VIN) U75.5(-IN)
N$38: C26.1 R15.1 U38.3(FREQ)
N$39: C26.2 D17.A L3.2 U38.8(SW)
N$40: D6.C R1.1 U2.4(-IN)
N$41: D17.C D18.A R19.2 U38.6(VDD) U38.7(BOOT)
N$42: D16.A U16.1(OUT)
N$43: D7.A U6.1(OUT)
N$44: C28.2 D56.C D57.C L9.1 R39.2
N$45: PAD19.1(P) R45.1 R46.2 R48.2 U57.4(FB)
N$46: C50.1 R44.1 U57.3(FREQ)
N$47: PAD4.1(P) R40.1 R41.2 R42.2 U28.4(FB)
N$48: C35.1 U69.6(V-)
N$49: C36.1 U69.1(C1+)
N$50: C36.2 U69.3(C1-)
N$51: C37.1 U69.4(C2+)
N$52: C16.1 R39.1 U28.3(FREQ)
N$53: C16.2 D59.A L9.2 U28.8(SW)
N$54: C37.2 U69.5(C2-)
N$55: J21.3 U69.14(T1OUT)
N$56: J21.2 U69.13(R1IN)
N$57: D59.C D60.A R40.2 U28.2(EN) U28.6(VDD) U28.7(BOOT)
N$58: J1.3 R21.2
N$59: D22.A K1.8(1:-) Q1.1(C)
N$60: C134.2 PAD1.1(P) R1.2 R16.1 R35.2 U5.4(FB)
N$61: C50.2 D20.A L4.2 U57.8(SW)
N$62: D20.C D21.A R45.2 U57.6(VDD) U57.7(BOOT)
N$63: D19.A U39.1(OUT)
N$64: LED3.A R89.1
N$65: C145.1 R81.1 U43.1(VIN) U76.5(-IN)
N$66: D58.A U23.1(OUT)
N$67: C154.1 R82.1 U47.1(VIN) U77.5(-IN)
N$68: C160.1 R83.1 U51.1(VIN) U78.5(-IN)
N$69: C128.2 PAD18.1(P) R4.2 R51.1 R52.2 U3.4(FB)
N$70: C166.1 R84.1 U54.1(VIN) U79.5(-IN)
N$71: C21.1 R85.1 U8.1(VIN) U80.5(-IN)
N$72: C83.+ S1.3
N$73: C90.+ S1.1
N$74: C81.+ S1.2
N$75: LED4.A R55.1
N$76: LED5.A R56.1
N$77: LED6.A R57.1
N$78: LED10.A R90.1
N$79: C84.+ S1.4
N$80: J12.4 R129.2
N$83: C70.2 D61.C D62.C L11.1 R68.2
N$87: LED7.A R58.1
N$88: LED8.A R59.1
N$89: LED9.A R60.1
N$90: R69.1 R70.2 R71.2 U32.4(FB)
N$94: C69.1 R68.1 U32.3(FREQ)
N$96: C69.2 D64.A L11.2 U32.8(SW)
N$97: D64.C D65.A R69.2 U32.6(VDD) U32.7(BOOT)
N$98: D63.A U29.1(OUT)
N$99: L17.1 U5.5(SW)
N$100: D6.A U2.1(OUT)
N$101: PAD6.1(P) R75.1 R97.2 R111.2 U42.4(FB)
N$102: J20.1 U67.1(OUT) U67.4(-IN)
N$103: C114.1 R74.1 U42.3(FREQ)
N$104: C114.2 D69.A L12.2 U42.8(SW)
N$106: D69.C D70.A R75.2 U42.2(EN) U42.6(VDD) U42.7(BOOT)
N$114: J32.1 K1.3(2:P)
N$115: D68.A U33.1(OUT)
N$118: J32.2 K1.6(3:P)
N$119: D32.A K3.8(1:-) Q4.1(C)
N$120: J28.1 K3.3(2:P)
N$121: D23.C J31.1 K1.4(2:S)
N$122: J28.2 K3.6(3:P)
N$123: D33.A K4.8(1:-) Q5.1(C)
N$126: J30.1 K2.3(2:P)
N$128: D30.C J29.1 K2.4(2:S)
N$130: J30.2 K2.6(3:P)
N$131: R91.1 U$25.15(ASC/AD5/DIO5)
N$133: LED2.A R91.2
N$135: D34.C J27.1 K3.4(2:S)
N$136: R96.1 U81.15(GPIO5)
N$138: D35.C J25.1 K4.4(2:S)
N$141: J26.1 K4.3(2:P)
N$142: J26.2 K4.6(3:P)
N$152: D8.C R47.1 U9.4(-IN)
N$153: J24.1 U68.12(A)
N$154: J24.2 U68.11(B)
N$155: J23.1 U68.10(Z)
N$156: J23.2 U68.9(Y)
N$169: J12.1 U71.1(VCC)
N$170: J12.2 U71.2(IO1)
N$171: J12.3 U71.3(IO2)
N$172: J12.5 U71.4(GND)
N$173: C142.2 PAD8.1(P) R47.2 R103.1 R104.2 U21.4(FB)
N$174: L18.1 U21.5(SW)
N$175: D8.A U9.1(OUT)
N$176: D42.A U50.1(OUT)
N$187: D9.C R105.1 U25.4(-IN)
N$188: C151.2 PAD9.1(P) R105.2 R107.1 R108.2 U43.4(FB)
N$189: L19.1 U43.5(SW)
N$190: D9.A U25.1(OUT)
N$192: D10.C R109.1 U44.4(-IN)
N$193: C157.2 PAD10.1(P) R109.2 R114.1 R115.2 U47.4(FB)
N$194: L20.1 U47.5(SW)
N$195: D10.A U44.1(OUT)
N$197: D11.C R116.1 U48.4(-IN)
N$198: C163.2 PAD11.1(P) R116.2 R118.1 R119.2 U51.4(FB)
N$199: L21.1 U51.5(SW)
N$200: D11.A U48.1(OUT)
N$202: D12.C R120.1 U52.4(-IN)
N$203: C169.2 PAD12.1(P) R120.2 R122.1 R123.2 U54.4(FB)
N$204: L22.1 U54.5(SW)
N$205: D12.A U52.1(OUT)
PE: C2.1 C3.1 C5.1 C7.1 C8.1 C9.2 C10.1 C11.1 C12.2 C13.1 C14.1 C15.1 C17.1 C18.1 C19.2 C20.2 C21.2 C22.2 C23.1 C24.1 C25.2 C27.1 C28.1 C29.1 C30.2 C31.1 C32.2 C34.2 C35.2 C38.1 C39.2 C40.1 C41.1 C42.2 C43.1 C44.1 C45.2 C46.1 C47.1 C48.2 C49.2 C51.1 C52.1 C53.2 C54.1 C55.1 C56.2 C57.2 C58.2 C59.1 C60.1 C61.1 C62.1 C63.1 C64.1 C65.1 C66.1 C67.2 C68.2 C70.1 C71.1 C72.2 C73.1 C74.1 C75.1 C76.1 C77.1 C78.1 C79.1 C80.1 C81.- C82.1 C83.- C84.- C85.1 C90.- C91.1 C92.2 C93.1 C95.1 C96.1 C97.1 C98.1 C99.1 C101.1 C102.1 C103.1 C105.1 C106.1 C107.1 C108.1 C109.1 C110.1 C111.2 C112.1 C115.1 C121.1 C122.1 C127.1 C129.2 C130.2 C131.2 C132.2 C133.1 C135.1 C137.1 C138.2 C139.2 C140.2 C141.1 C143.1 C144.2 C145.2 C146.2 C147.1 C148.1 C149.2 C150.1 C152.1 C153.2 C154.2 C155.2 C156.1 C158.1 C159.2 C160.2 C161.2 C162.1 C164.1 C165.2 C166.2 C167.2 C168.1 D1.A D52.A D57.A D62.A J5.1 J13.1 J17.1 J17.2 J17.3 J17.4 J18.1 J19.1 J20.2 J25.2 J27.2 J29.2 J31.2 J41.3 J41.5 J41.7 J41.9 K1.5(3:S) K2.5(3:S) K3.5(3:S) K4.5(3:S) LED1.C LED2.C Q1.3(E) Q3.3(E) Q4.3(E) Q5.3(E) R10.1 R18.1 R21.1 R27.1 R35.1 R38.1 R41.1 R43.1 R46.1 R52.1 R70.1 R86.2 R94.1 R95.2 R96.2 R97.1 R104.1 R108.1 R115.1 R119.1 R123.1 R126.1 R128.1 RESET_SW.3 RESET_SW.4 SW1.1 SW1.2 SW2.1 SW2.2 SW3.1 SW3.2 U1.10(VSS_5) U1.20(VSSA) U1.27(VSS_4) U1.74(VSS_2) U1.94(BOOT0) U2.5(V-) U3.2(GND) U4.2(V-) U5.2(GND) U6.5(V-) U7.2(V-) U8.2(GND) U9.5(V-) U10.2(V-) U11.5(V-) U12.6(GND) U13.2(V-) U14.2(V-) U15.1(PGND) U15.5(SGND) U16.5(V-) U17.5(V-) U18.2(V-) U19.2(V-) U20.2(V-) U21.2(GND) U22.1(PGND) U22.5(SGND) U23.5(V-) U24.2(V-) U25.5(V-) U26.2(V-) U27.2(V-) U28.1(PGND) U28.5(SGND) U29.5(V-) U30.2(V-) U31.2(V-) U32.1(PGND) U32.5(SGND) U33.5(V-) U34.2(V-) U35.2(V-) U36.2(V-) U37.2(V-) U38.1(PGND) U38.5(SGND) U39.5(V-) U40.1(PGND) U40.5(SGND) U41.2(V-) U42.1(PGND) U42.5(SGND) U43.2(GND) U44.5(V-) U45.5(V-) U46.2(V-) U47.2(GND) U48.5(V-) U49.2(V-) U50.5(V-) U51.2(GND) U52.5(V-) U53.2(V-) U54.2(GND) U55.2(V-) U56.2(V-) U57.1(PGND) U57.5(SGND) U58.2(VSS) U59.3(~WP) U59.4(GND) U60.3(~WP) U60.4(GND) U61.12(GND1) U61.34(GND2) U62.12(GND) U63.12(GND) U63.15(INH) U64.12(GND) U64.15(INH) U65.3(GND) U66.8(GND) U67.5(V-) U68.6(GND) U68.7(GND) U69.15(GND) U70.2(V-) U71.5(GND) U72.8(GND) U73.12(GND) U73.15(INH) U74.2(V-) U75.2(V-) U76.2(V-) U77.2(V-) U78.2(V-) U79.2(V-) U80.2(V-) U81.10(GND) U82.2(V-) U$25.10(GND) ; supply symbol labelled DGND
RAWV0: C19.1 C128.1 L13.2 R51.2 R64.2 U13.4(+IN)
RAWV1: C132.1 C134.1 L17.2 R12.2 R16.2 U4.4(+IN)
RAWV2: C140.1 C142.1 L18.2 R61.2 R103.2 U10.4(+IN)
RAWV3: R106.2 U26.4(+IN)
RAWV4: R110.2 U46.4(+IN)
RAWV5: C161.1 C163.1 L21.2 R117.2 R118.2 U49.4(+IN)
RAWV6: C167.1 C169.1 L22.2 R121.2 R122.2 U53.4(+IN)
RAWV7: C57.1 C136.1 L1.2 R3.2 R9.2 U7.4(+IN)
SDCS: R124.2 U1.90(PB4) U12.2(CS)
SF0CS: R102.2 U1.95(PB8) U59.1(~CS)
UART1RX: U1.93(PB7) U68.2(RO)
UART1TX: U1.92(PB6) U68.5(DI)
UART3RX: R26.1 U1.48(PB11) U$25.2(DOUT)
UART3TX: R88.1 U1.47(PB10) U$25.3(DIN/~CFG)
UART4RX: R92.1 U1.79(PC11) U81.2(DOUT)
UART4TX: R93.1 U1.78(PC10) U81.3(DIN/~CFG)
UART5RX: U1.83(PD2) U69.12(R1OUT)
UART5TX: U1.80(PC12) U69.11(T1IN)
UART6RX: U1.64(PC7) U69.9(R2OUT)
UART6TX: U1.63(PC6) U69.10(T2IN)
USB5V_F: F1.P$1 J11.3 R77.1 R77.2 U1.68(PA9)
USB_ID: R129.1 U1.51(PB12)
USBD+: R32.2 U71.6(IO2)
USBD-: R31.2 U71.7(IO1)
USBLED: LED1.A R33.2 U1.69(PA10)
V0: C101.2 C102.2 C103.2 C105.2 C106.2 C107.2 C108.2 C109.2 J41.1 PAD13.1(P) R62.1 R64.1 U1.6(VBAT) U1.11(VDD_5) U1.19(VDD12) U1.22(VDDA) U1.28(VDD_4) U1.49(VCAP_1) U1.50(VDD_1) U1.73(VCAP_2) U1.75(VDD_2) U1.100(VDD_3) U13.5(-IN) U73.9(X0)
V1: C3.2 C5.2 C7.2 C10.2 C11.2 C14.2 C18.2 C24.2 C29.2 C31.2 C40.2 C41.2 C46.2 C47.2 C52.2 C54.2 C55.2 C62.2 C63.2 C64.2 C65.2 C66.2 C71.2 C73.2 C74.2 C75.2 C76.2 C77.2 C78.2 C79.2 C80.2 C82.2 C91.2 C93.2 C98.2 C110.2 C112.2 C121.2 C122.2 C127.2 C133.2 C135.2 C137.2 C141.2 C143.2 C147.2 C148.2 C150.2 C152.2 C156.2 C158.2 C162.2 C164.2 C168.2 PAD14.1(P) R12.1 R87.2 U2.2(V+) U4.3(V+) U4.5(-IN) U6.2(V+) U7.3(V+) U9.2(V+) U10.3(V+) U11.2(V+) U13.3(V+) U14.3(V+) U16.2(V+) U17.2(V+) U18.3(V+) U19.3(V+) U20.3(V+) U23.2(V+) U24.3(V+) U25.2(V+) U26.3(V+) U27.3(V+) U29.2(V+) U30.3(V+) U31.3(V+) U33.2(V+) U34.3(V+) U35.3(V+) U36.3(V+) U37.3(V+) U39.2(V+) U41.3(V+) U44.2(V+) U45.2(V+) U46.3(V+) U48.2(V+) U49.3(V+) U50.2(V+) U52.2(V+) U53.3(V+) U55.3(V+) U56.3(V+) U62.24(VCC) U63.24(VCC) U64.24(VCC) U65.1(IN) U66.16(VCC) U70.3(V+) U73.8(X1) U73.24(VCC) U74.3(V+) U75.3(V+) U76.3(V+) U77.3(V+) U78.3(V+) U79.3(V+) U80.3(V+) U82.3(V+)
V1EN: U1.35(PB0) U5.3(EN)
V2: C60.2 C61.2 PAD15.1(P) R61.1 U10.5(-IN) U61.11(VDD1) U61.33(VDD2) U73.7(X2)
V2EN: U21.3(EN) U66.6(Q2)
V3: C15.2 C23.2 C43.2 C44.2 C59.2 C92.1 PAD20.1(P) R34.2 R63.2 R65.2 R99.1 R100.1 R101.1 R102.1 R106.1 R124.1 R125.1 U12.4(VCC) U26.5(-IN) U58.1(VCORE) U58.8(VDD) U59.8(VCC) U60.8(VCC) U73.6(X3)
V3EN: U43.3(EN) U66.7(Q3)
V3RAW: C146.1 C151.1 L19.2 R107.2
V4: PAD21.1(P) R8.1 R110.1 U46.5(-IN) U73.5(X4)
V4EN: U47.3(EN) U66.9(Q4)
V4RAW: C155.1 C157.1 L20.2 R114.2
V5: C33.2 C34.1 C38.2 C39.1 C95.2 C96.2 C97.2 PAD22.1(P) R26.2 R33.1 R88.2 R92.2 R93.2 R117.1 U49.5(-IN) U68.13(NC) U68.14(VCC) U69.16(VCC) U73.4(X5) U81.1(VDD) U$25.1(VCC)
V5EN: U51.3(EN) U66.10(Q5)
V6: C85.2 C99.2 PAD23.1(P) R13.2 R29.2 R53.2 R55.2 R56.2 R57.2 R58.2 R59.2 R60.2 R89.2 R90.2 R121.1 R127.2 U53.5(-IN) U67.2(V+) U72.16(VCC) U73.3(X6)
V6EN: U54.3(EN) U66.11(Q6)
V7: D22.C D23.A D31.C D32.C D33.C K1.1(1:+) K2.1(1:+) K3.1(1:+) K4.1(1:+) PAD24.1(P) R3.1 U7.5(-IN) U73.2(X7)
V7EN: U8.3(EN) U66.12(Q7)
VUSB: F1.P$2 U71.8(VCC)
XBE_RST: U1.87(PD6) U$25.5(~RESET)
~485_RE: U1.65(PC8) U68.3(RE/)
Unconnected: J1.1 J2.3 J3.3 J4.3 J6.3 J7.3 J11.1 J21.1 J21.4 J21.6 J21.7 J21.8 J21.9 K1.2(2:O) K1.7(3:O) K2.2(2:O) K2.7(3:O) K3.2(2:O) K3.7(3:O) K4.2(2:O) K4.7(3:O) U1.21(VREF+) U1.99(RFU) U58.7(NC) U68.1(NC) U68.8(NC) U81.4(GPIO7) U81.9(GPIO11) U81.11(GPIO8) U81.14(NC) U81.17(GPIO3) U81.18(GPIO1) U81.19(AIO0) U81.20(AIO1) U$25.4(NC) U$25.6(PWM0/RSSI) U$25.7(PWM1) U$25.8(RSRVD) U$25.9(~DTR/SLP/D18) U$25.11(AD4/DIO4) U$25.12(~CTS/DIO7) U$25.13(ON/~SLP) U$25.14(VREF) U$25.16(~RTS/DIO6) U$25.17(AD3/DIO3) U$25.18(AD2/DIO2) U$25.19(AD1/DIO1) U$25.20(AD0/DIO0)

## Buses
D[0..15],A[16..23]
MCUSDI,MCUSDO,MCUSCK,EEHLD,EE0CS,SF0CS,HIHCS,HIHALM,SDCS

## Notes on the sheet
- Voltage Step Down and Modulation
- USB Interface
- USB PWR JMPR
- 1V-6V Switchable Output
- *Note Buck1 Always Enabled
- Power Input, Voltage Boost and Modulation
- Only 3adcs... | You need to voltage divide this!
- Reserved for future use
- Measuring EXTVREF instead
- Always booting from internal flash
- Multiplexed Address/Data Bus
- SPI1 Max is 15Mbit/s
- V1EN Controlled from MCU | Pin13 to VCC per Datasheet
- BOOST4EN Controlled from MCU
- BOOST5EN Controlled from MCU
- *See NOTE1 regarding SPI communication
- *RTC clocked by internal low power RC
- 3V - 5.5V
- Energy Storage, Voltage Boost and Modulation
- *Note that V4 should be disabled when this circuit is active
- *NOTE Can be 0ohm
- SDA->HIHALM
- SCL
- Buck Peripheral Key | Boost Peripherals
- 0) STM32F205 Microcontroller | 5) 0-10Vout + RLY1 Out
- 1) Measurement and Control | 6) 0-10Vout + RLY2 Out
- 2) Parallel RAM (1MB), 35mA | 7) 0-10Vout + RLY3 Out
- 3) SPI Devices
- 4) Energy Storage Devices
- 5) Communications Devices | LAB304 LLC
- *NOTE1: Voltage domains V0 and V3 must match for proper communication
- 6) I/O (LEDs + Buttons + DAC)
- 7) Relays (Latching + Non), 47mA
- 8) 1V-6Vout + RLY0 Out
- Total Budget: 263mA | 0

## Library data of the parts
C1-C11 C13-C24 C26-C48 C50-C55 C57-C66 C69-C80 C82 C85 C91-C93 C95-C99 C101-C103 C105-C110 C112 C114 C115 C121 C122 C127-C148 C150-C169 = rcl:C-EU: CAPACITOR, European symbol
C12 C25 C49 C56 C67 C68 C111 C149 = rcl:C-US: CAPACITOR, American symbol
C81 C83 C84 C90 = rcl:CPOL-US: POLARIZED CAPACITOR, American symbol
D1-D5 D13-D23 D51-D65 D68-D70 = diode:DIODE-: DIODE
D6-D12 D30-D35 D42 = IKE:LSM115JE3: Z DIODE
F1 = smd-ipc:FUSE(1210)
J1-J4 J6 J7 J11 = jumper:J2: Jumper switch 2 x 2.5 mm
J5 J13 J18-J20 J22-J32 = con-phoenix-254:MPT2: PHOENIX CONNECTOR; OC_FARNELL: unknown; OC_NEWARK: unknown
J12 = IKE:MINI-USB-: MINI USB Connector Source: http://www.hirose.co.jp/cataloge_hp/e24000019.pdf; OC_FARNELL: unknown; OC_NEWARK: unknown
J17 = con-lsta:FE08-1: FEMALE HEADER; OC_FARNELL: unknown; OC_NEWARK: unknown
J21 = con-thomas-betts:D-SUB9-: D-Subminiatur Connector Source: Electronioc Interconnects European Edition 1998; OC_FARNELL: unknown; OC_NEWARK: unknown
J41 = con-leotronics:1296-T10: 1.27mm SINGLE ROW FEMALE SOCKET Source: http://www.leotronics.co.uk/Conexcon/Data%20Sheets/sec.%20A/1296ing.pdf; OC_FARNELL: unknown; OC_NEWARK: unknown
K1 = IKE:G6K: Low Signal Relay oeiwcsnts1.omron.com/.. D20G6K0100.pdf; MF: OMRON COMPONENTS USA; MPN: G6KU-2P-Y DC5; OC_FARNELL: unknown; OC_NEWARK: 35K4536
K2 = IKE:G6K: Low Signal Relay oeiwcsnts1.omron.com/.. D20G6K0100.pdf; MF: OMRON COMPONENTS USA; MPN: G6KU-2F-Y DC3; OC_FARNELL: unknown; OC_NEWARK: 89C6496
K3 = IKE:G6K: Low Signal Relay oeiwcsnts1.omron.com/.. D20G6K0100.pdf; MF: OMRON COMPONENTS USA; MPN: G6K-2P DC3; OC_FARNELL: 3937276; OC_NEWARK: 89C6482
K4 = IKE:G6K: Low Signal Relay oeiwcsnts1.omron.com/.. D20G6K0100.pdf; MF: OMRON COMPONENTS USA; MPN: G6K-2G DC12; OC_FARNELL: 4601695; OC_NEWARK: 93B9118
L1-L4 L8-L13 L17-L22 = IKE:LQM2HP_G0
LED1-LED10 = led:LED: LED OSRAM: - CHIPLED LG R971, LG N971, LY N971, LG Q971, LY Q971, LO R971, LY R971 LH N974, LH R974 LS Q976, LO Q976, LY Q976 LO Q996 - Hyper CHIPLED LW Q18S LB Q993, LB Q99A, LB R99A - SideLED LS A670, LO A670, LY A670, LG A670, LP A670 LB A673, LV A673, LT A673, LW A673 LH A674 LY A675 LS A676, LA A676, LO A676, LY A676, LW A676 LS A679, LY A679, LG A679 - Hyper Micro SIDELED® LS Y876, LA Y876, LO Y876, LY Y876 LT Y87S - SmartLED LW L88C, LW L88S LB L89C, LB L89S, LG L890 LS L89K, LO L89K, LY L89K LS L896, LA L896, LO L896, LY L896 - TOPLED LS T670, LO T670, LY T670, LG T670, LP T670 LSG T670, LSP T670, LSY T670, LOP T670, LYG T670 LG T671, LOG T671, LSG T671 LB T673, LV T673, LT T673, LW T673 LH T674 LS T676, LA T676, LO T676, LY T676, LB T676, LH T676, LSB T676, LW T676 LB T67C, LV T67C, LT T67C, LS T67K, LO T67K, LY T67K, LW E67C LS E67B, LA E67B, LO E67B, LY E67B, LB E67C, LV E67C, LT E67C LW T67C LS T679, LY T679, LG T679 LS T770, LO T770, LY T770, LG T770, LP T770 LB T773, LV T773, LT T773, LW T773 LH T774 LS E675, LA E675, LY E675, LS T675 LS T776, LA T776, LO T776, LY T776, LB T776 LHGB T686 LT T68C, LB T68C - Hyper Mini TOPLED® LB M676 - Mini TOPLED Santana® LG M470 LS M47K, LO M47K, LY M47K Source: http://www.osram.convergy.de LUXEON: - LUMILED® LXK2-PW12-R00, LXK2-PW12-S00, LXK2-PW14-U00, LXK2-PW14-V00 LXK2-PM12-R00, LXK2-PM12-S00, LXK2-PM14-U00 LXK2-PE12-Q00, LXK2-PE12-R00, LXK2-PE12-S00, LXK2-PE14-T00, LXK2-PE14-U00 LXK2-PB12-K00, LXK2-PB12-L00, LXK2-PB12-M00, LXK2-PB14-N00, LXK2-PB14-P00, LXK2-PB14-Q00 LXK2-PR12-L00, LXK2-PR12-M00, LXK2-PR14-Q00, LXK2-PR14-R00 LXK2-PD12-Q00, LXK2-PD12-R00, LXK2-PD12-S00 LXK2-PH12-R00, LXK2-PH12-S00 LXK2-PL12-P00, LXK2-PL12-Q00, LXK2-PL12-R00 Source: www.luxeon.com KINGBRIGHT: KA-3528ASYC Source: www.kingbright.com
PAD1-PAD24 = wirepad:2,54/1,0: THROUGH-HOLE PAD
Q1 Q3-Q5 = zetex:NPNSOT323: NPN TRANSISTOR; MPN: DSS4160U-7; OC_FARNELL: 1710696; OC_NEWARK: 25R4558
R1-R129 = rcl:R-US_: RESISTOR, American symbol
RESET_SW SW1-SW3 = smd-ipc:SWITCH(B3SN)
S1 = smd-special:SWS004: SMD Dip Switch 4 pol.
U1 = IKE:STM32F205VG
U2 U6 U9 U11 U16 U17 U23 U25 U29 U33 U39 U44 U45 U48 U50 U52 U67 = linear:MCP601: Single Op Amp 2.7V to 6.0V Single Supply CMOS Source: http://ww1.microchip.com/downloads/en/DeviceDoc/21314g.pdf
U3 U5 U8 U21 U43 U47 U51 U54 = IKE:TPS62240DDC
U4 U7 U10 U13 U14 U18-U20 U24 U26 U27 U30 U31 U34-U37 U41 U46 U49 U53 U55 U56 U70 U74-U80 U82 = IKE:MAX4376
U12 = IKE:SF-MICROSD
U15 U22 U28 U32 U38 U40 U42 U57 = PEGMA:LM2623
U58 = IKE:HIH6131
U59 = PEGMA:25MPX
U60 = IKE:25AA512
U61 = IKE:IS61WV51216: Source: CYPRESS cy7c1059dv33_8.pdf
U62-U64 U73 = IKE:4067: 16-channel ANALOG MULTIPLEXER
U65 = maxim:MAX6520: 1.2V Voltage Reference 50ppm/°C, SOT23, 3-Terminal Source: Data sheet <http://datasheets.maxim-ic.com/en/ds/MAX6520.pdf>; MF: MAXIM; MPN: MAX6520EUR-T; OC_FARNELL: unknown; OC_NEWARK: 02J4586
U66 U72 = PEGMA:74*259: 8-bit addressable LATCH
U68 = maxim:MAX489CSD: RS485 TRANSEIVER; MF: MAXIM; MPN: MAX489CSD; OC_FARNELL: 9724559; OC_NEWARK: 34C3923
U69 = maxim:MAX232ECWE: RS232 TRANSCEIVER; MF: MAXIM; MPN: MAX232ECWE+; OC_FARNELL: 9724435; OC_NEWARK: 67K4440
U71 = st-microelectronics:USB6B1: DATA LINES PROTECTION Source: http://www.st.com/stonline/products/literature/ds/5605.pdf; MPN: USB6B1; OC_FARNELL: 9804358; OC_NEWARK: 26M4750
U81 = IKE:RN42XV
U$25 = IKE:XBEE802.15.4
Y1 = crystal:CRYSTAL: CRYSTAL; OC_FARNELL: unknown; OC_NEWARK: unknown